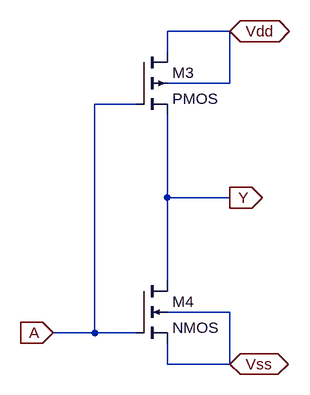
[diagram p0: schematic inv1.asc]
inv1.asc, the LTspice schematic file:
Version 4
SHEET 1 880 680
WIRE 240 -48 144 -48
WIRE 144 -16 144 -48
WIRE 240 32 240 -48
WIRE 240 32 144 32
WIRE 96 64 32 64
WIRE 144 208 144 80
WIRE 240 208 144 208
WIRE 144 336 144 208
WIRE 240 384 144 384
WIRE 32 416 32 64
WIRE 32 416 -32 416
WIRE 96 416 32 416
WIRE 144 464 144 432
WIRE 240 464 240 384
WIRE 240 464 144 464
FLAG 240 -48 Vdd
IOPIN 240 -48 BiDir
FLAG 240 464 Vss
IOPIN 240 464 BiDir
FLAG -32 416 A
IOPIN -32 416 In
FLAG 240 208 Y
IOPIN 240 208 Out
SYMBOL pmos4 96 -16 R0
SYMATTR InstName M3
SYMATTR Value2 l=0.2u w=1u ad=0.5p as=0.5p
SYMBOL nmos4 96 336 R0
SYMATTR InstName M4
SYMATTR Value2 l=0.2u w=0.5u ad=0.25p as=0.25p

The netlist it stands for:
* inv1.asc
M3 Vdd A Y Vdd PMOS l=0.2u w=1u ad=0.5p as=0.5p
M4 Y A Vss Vss NMOS l=0.2u w=0.5u ad=0.25p as=0.25p
.model NMOS NMOS
.model PMOS PMOS
.lib standard.mos
.backanno
.end